# EAGLE design touch_pot (EAGLE 7.2.0)
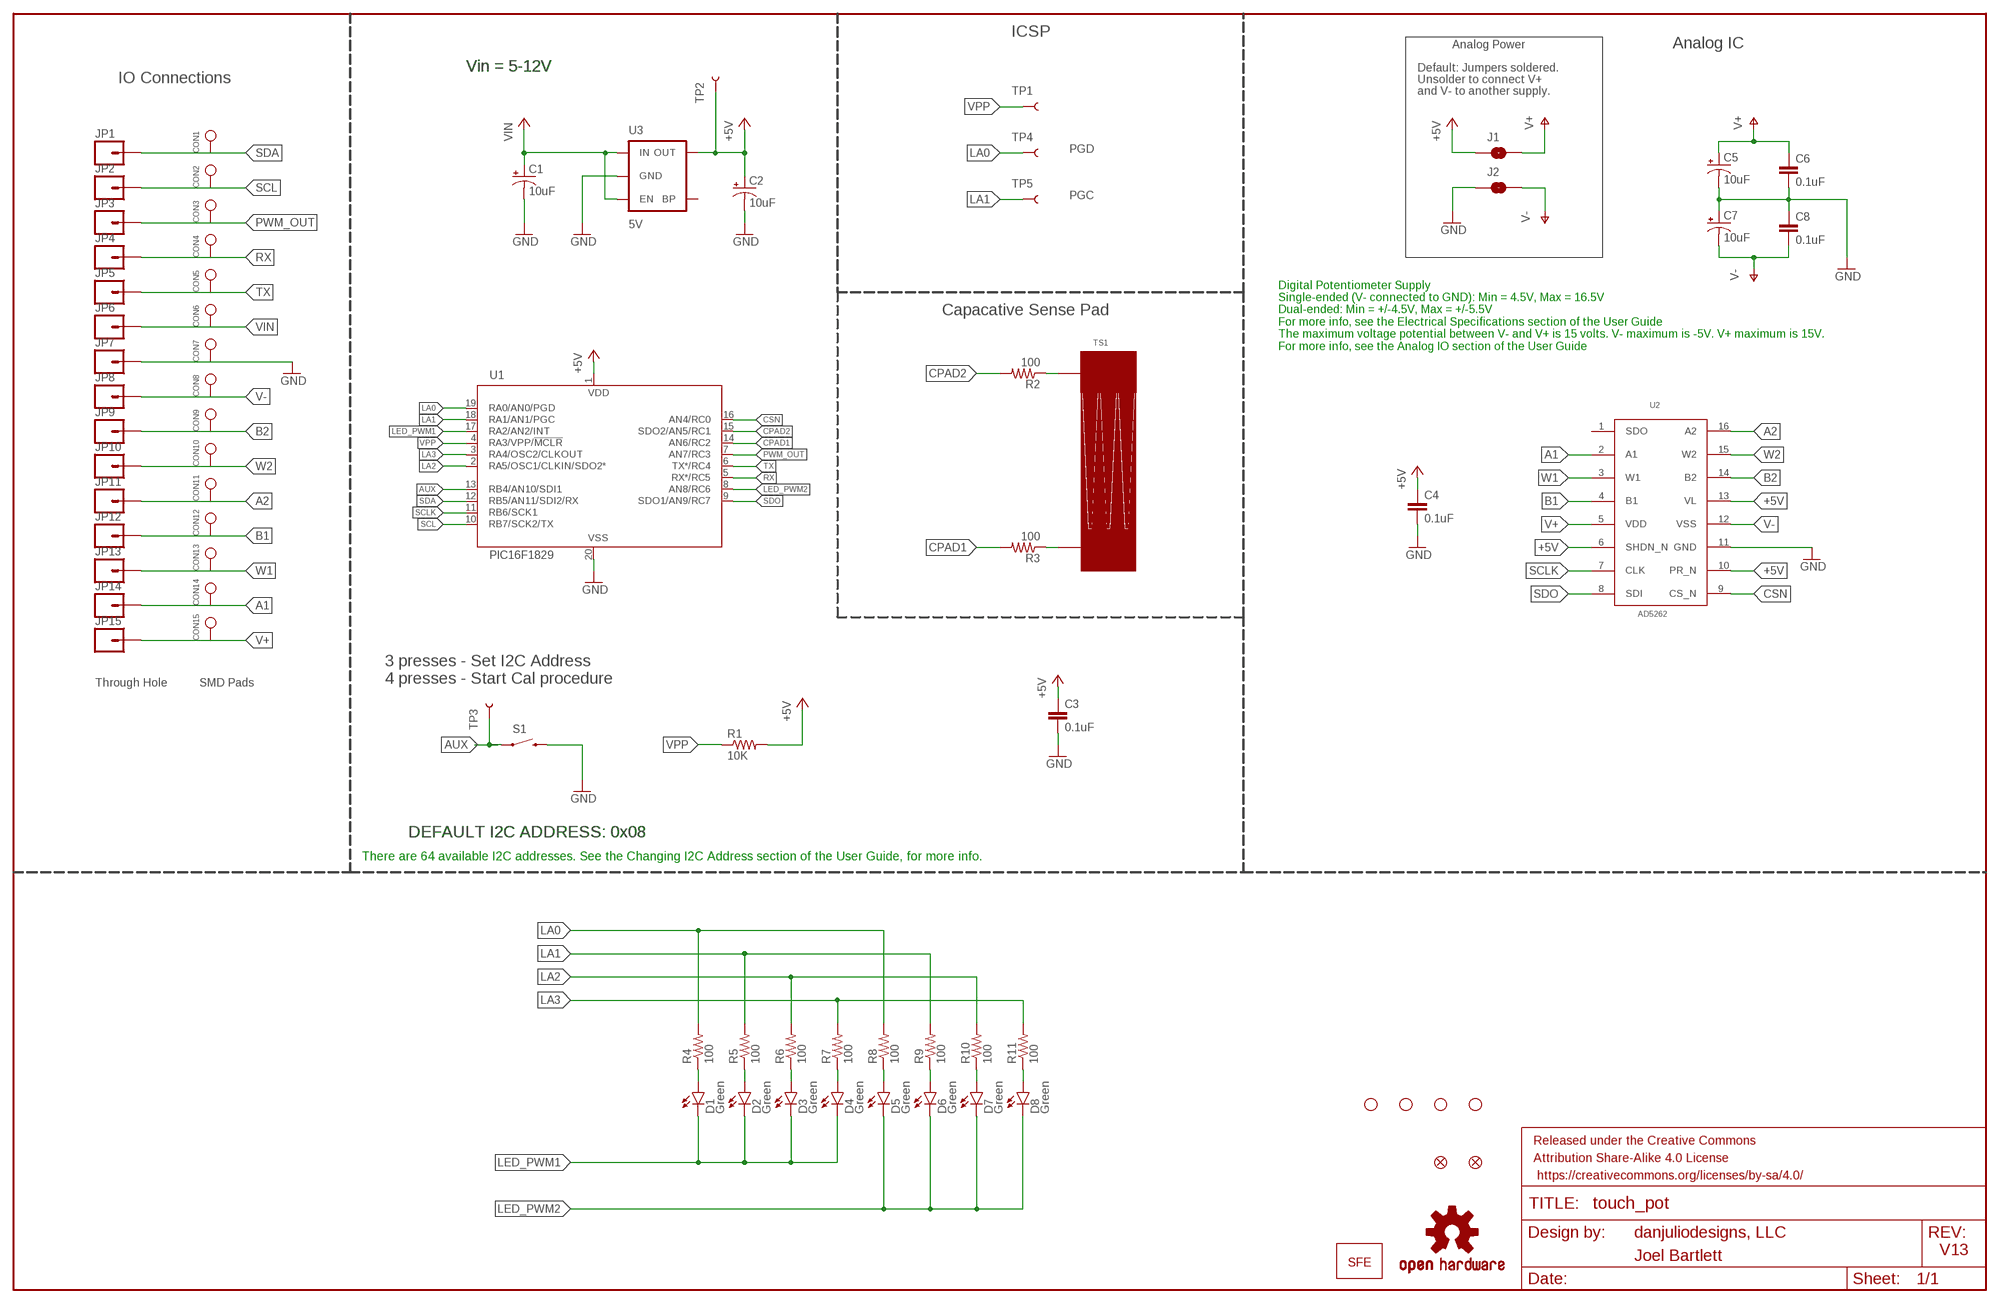
[diagram p0: schematic, sheet 1]

## Parts
C1  10uF  10UF-16V-10%(TANT)  [EIA3216]
C2  10uF  10UF-16V-10%(TANT)  [EIA3216]
C3  0.1uF  0.1UF-25V(+80/-20%)(0603)  [0603-CAP]
C4  0.1uF  0.1UF-25V(+80/-20%)(0603)  [0603-CAP]
C5  10uF  10UF-16V-10%(TANT)  [EIA3216]
C6  0.1uF  0.1UF-25V(+80/-20%)(0603)  [0603-CAP]
C7  10uF  10UF-16V-10%(TANT)  [EIA3216]
C8  0.1uF  0.1UF-25V(+80/-20%)(0603)  [0603-CAP]
CON1  SINGLE_PADSMD  [2MM_SMD_PAD]
CON2  SINGLE_PADSMD  [2MM_SMD_PAD]
CON3  SINGLE_PADSMD  [2MM_SMD_PAD]
CON4  SINGLE_PADSMD  [2MM_SMD_PAD]
CON5  SINGLE_PADSMD  [2MM_SMD_PAD]
CON6  SINGLE_PADSMD  [2MM_SMD_PAD]
CON7  SINGLE_PADSMD  [2MM_SMD_PAD]
CON8  SINGLE_PADSMD  [2MM_SMD_PAD]
CON9  SINGLE_PADSMD  [2MM_SMD_PAD]
CON10  SINGLE_PADSMD  [2MM_SMD_PAD]
CON11  SINGLE_PADSMD  [2MM_SMD_PAD]
CON12  SINGLE_PADSMD  [2MM_SMD_PAD]
CON13  SINGLE_PADSMD  [2MM_SMD_PAD]
CON14  SINGLE_PADSMD  [2MM_SMD_PAD]
CON15  SINGLE_PADSMD  [2MM_SMD_PAD]
D1  Green  LED-GREEN1206-BOTTOM  [LED-1206-BOTTOM]
D2  Green  LED-GREEN1206-BOTTOM  [LED-1206-BOTTOM]
D3  Green  LED-GREEN1206-BOTTOM  [LED-1206-BOTTOM]
D4  Green  LED-GREEN1206-BOTTOM  [LED-1206-BOTTOM]
D5  Green  LED-GREEN1206-BOTTOM  [LED-1206-BOTTOM]
D6  Green  LED-GREEN1206-BOTTOM  [LED-1206-BOTTOM]
D7  Green  LED-GREEN1206-BOTTOM  [LED-1206-BOTTOM]
D8  Green  LED-GREEN1206-BOTTOM  [LED-1206-BOTTOM]
FID1  FIDUCIAL1X2  [FIDUCIAL-1X2]
FID2  FIDUCIAL1X2  [FIDUCIAL-1X2]
FRAME3  FRAME-LEDGER  [CREATIVE_COMMONS]
J1  SJCLOSED  [SJ_2S]
J2  SJCLOSED  [SJ_2S]
JP1  M01SMDNS  [1X01NS]
JP2  M01SMDNS  [1X01NS]
JP3  M01SMDNS  [1X01NS]
JP4  M01SMDNS  [1X01NS]
JP5  M01SMDNS  [1X01NS]
JP6  M01SMDNS  [1X01NS]
JP7  M01SMDNS  [1X01NS]
JP8  M01SMDNS  [1X01NS]
JP9  M01SMDNS  [1X01NS]
JP10  M01SMDNS  [1X01NS]
JP11  M01SMDNS  [1X01NS]
JP12  M01SMDNS  [1X01NS]
JP13  M01SMDNS  [1X01NS]
JP14  M01SMDNS  [1X01NS]
JP15  M01SMDNS  [1X01NS]
R1  10K  10KOHM-1/10W-1%(0603)0603  [0603-RES]
R2  100  100OHM-1/10W-1%(0603)  [0603-RES]
R3  100  100OHM-1/10W-1%(0603)  [0603-RES]
R4  100  100OHM-1/10W-1%(0603)  [0603-RES]
R5  100  100OHM-1/10W-1%(0603)  [0603-RES]
R6  100  100OHM-1/10W-1%(0603)  [0603-RES]
R7  100  100OHM-1/10W-1%(0603)  [0603-RES]
R8  100  100OHM-1/10W-1%(0603)  [0603-RES]
R9  100  100OHM-1/10W-1%(0603)  [0603-RES]
R10  100  100OHM-1/10W-1%(0603)  [0603-RES]
R11  100  100OHM-1/10W-1%(0603)  [0603-RES]
S1  SWITCH-MOMENTARY-2SMD  [TACTILE-SWITCH-SMD]
STANDOFF1  STAND-OFFTIGHT  [STAND-OFF-TIGHT]
STANDOFF2  STAND-OFFTIGHT  [STAND-OFF-TIGHT]
STANDOFF3  STAND-OFFTIGHT  [STAND-OFF-TIGHT]
STANDOFF4  STAND-OFFTIGHT  [STAND-OFF-TIGHT]
TP1  TEST-POINT3X4  [PAD.03X.04]
TP2  TEST-POINT3X4  [PAD.03X.04]
TP3  TEST-POINT3X4  [PAD.03X.04]
TP4  TEST-POINT3X4  [PAD.03X.04]
TP5  TEST-POINT3X4  [PAD.03X.04]
TS1  2CH_LINEAR_TOUCH  [2CH_48MM_LINEAR_TOUCH]
U1  PIC16F1829  [SSOP20]
U2  AD5262  [SSOP16]
U3  5V  V_REG_MIC52055V  [SOT23-5]
U$4  OSHW-LOGOM  [OSHW-LOGO-M]
U$5  SFE_LOGO_NAME_WEB  [SFE-NEW-WEBLOGO]

## Nets
+5V: C2.A(+) C3.1 C4.1 J1.1 R1.2 TP2.P$1 U1.1(VDD) U2.6(SHDN_N) U2.10(PR_N) U2.13(VL) U3.5(OUT)
A1: CON14.P$1 JP14.1 U2.2(A1)
A2: CON11.P$1 JP11.1 U2.16(A2)
AUX: S1.1 TP3.P$1 U1.13(RB4/AN10/SDI1)
B1: CON12.P$1 JP12.1 U2.4(B1)
B2: CON9.P$1 JP9.1 U2.14(B2)
CPAD1: R3.2 U1.14(AN6/RC2)
CPAD2: R2.2 U1.15(SDO2/AN5/RC1)
CSN: U1.16(AN4/RC0) U2.9(CS_N)
GND: C1.C(-) C2.C(-) C3.2 C4.2 C5.C(-) C6.2 C7.A(+) C8.1 CON7.P$1 J2.1 JP7.1 S1.3 U1.20(VSS) U2.11(GND) U3.2(GND)
LA0: R4.2 R8.2 TP4.P$1 U1.19(RA0/AN0/PGD)
LA1: R5.2 R9.2 TP5.P$1 U1.18(RA1/AN1/PGC)
LA2: R6.2 R10.2 U1.2(RA5/OSC1/CLKIN/SDO2*)
LA3: R7.2 R11.2 U1.3(RA4/OSC2/CLKOUT)
LED_PWM1: D1.C D2.C D3.C D4.C U1.17(RA2/AN2/INT)
LED_PWM2: D5.C D6.C D7.C D8.C U1.8(AN8/RC6)
N$1: D1.A R4.1
N$2: D2.A R5.1
N$3: D3.A R6.1
N$4: D4.A R7.1
N$5: D5.A R8.1
N$6: D6.A R9.1
N$7: D7.A R10.1
N$8: D8.A R11.1
N$37: R2.1 TS1.P$2
N$38: R3.1 TS1.P$1
PWM_OUT: CON3.P$1 JP3.1 U1.7(AN7/RC3)
RX: CON4.P$1 JP4.1 U1.5(RX*/RC5)
SCL: CON2.P$1 JP2.1 U1.10(RB7/SCK2/TX)
SCLK: U1.11(RB6/SCK1) U2.7(CLK)
SDA: CON1.P$1 JP1.1 U1.12(RB5/AN11/SDI2/RX)
SDO: U1.9(SDO1/AN9/RC7) U2.8(SDI)
TX: CON5.P$1 JP5.1 U1.6(TX*/RC4)
V+: C5.A(+) C6.1 CON15.P$1 J1.2 JP15.1 U2.5(VDD)
V-: C7.C(-) C8.2 CON8.P$1 J2.2 JP8.1 U2.12(VSS)
VIN: C1.A(+) CON6.P$1 JP6.1 U3.1(IN) U3.3(EN)
VPP: R1.1 TP1.P$1 U1.4(RA3/VPP/!MCLR)
W1: CON13.P$1 JP13.1 U2.3(W1)
W2: CON10.P$1 JP10.1 U2.15(W2)
Unconnected: U2.1(SDO) U3.4(BP)

## Notes on the sheet
- ICSP
- Analog Power | Analog IC
- Vin = 5-12V | Vin = 5-12V | Default: Jumpers soldered.
- IO Connections | Unsolder to connect V+
- and V- to another supply.
- PGD
- PGC
- Capacative Sense Pad
- Digital Potentiometer Supply
  Single-ended (V- connected to GND): Min = 4.5V, Max = 16.5V
  Dual-ended: Min = +/-4.5V, Max = +/-5.5V
  For more info, see the Electrical Specifications section of the User Guide
  The maximum voltage potential between V- and V+ is 15 volts. V- maximum is -5V. V+ maximum is 15V.
  For more info, see the Analog IO section of the User Guide
- 3 presses - Set I2C Address
  4 presses - Start Cal procedure
- Through Hole | SMD Pads
- DEFAULT I2C ADDRESS: 0x08 | DEFAULT I2C ADDRESS: 0x08
- There are 64 available I2C addresses. See the Changing I2C Address section of the User Guide, for more info.
- danjuliodesigns, LLC
- V13
- Joel Bartlett

## Library data of the parts
C1 C2 C5 C7 = SparkFun-Capacitors:10UF-16V-10%(TANT): CAP-00811 1206/EIA-3216 Tantalum capacitor; PROD_ID: CAP-00811
C3 C4 C6 C8 = SparkFun-Capacitors:0.1UF-25V(+80/-20%)(0603): CAP-00810 Ceramic Standard decoupling cap; PROD_ID: CAP-00810
CON1-CON15 = djd_eagle_library:SINGLE_PAD
D1-D8 = SparkFun-LED:LED-GREEN: Various green LEDs Green LEDs used in SFE Production 0603- DIO-00821 LARGE- DIO-00862 LILYPAD- DIO-09910; PROD_ID: DIO-11076
FID1 FID2 = SparkFun-Aesthetics:FIDUCIAL: Fiducial Alignment Points Various fiducial points for machine vision alignment.
FRAME3 = SparkFun-Aesthetics:FRAME-LEDGER: Schematic Frame Standard 11x14 US Ledger frame
J1 J2 = djd_eagle_library:SJ: Solder jumper
JP1-JP15 = SparkFun:M01: Header 1 Standard 1-pin 0.1" header. Use with straight break away headers (SKU : PRT-00116), right angle break away headers (PRT-00553), swiss pins (PRT-00743), machine pins (PRT-00117), and female headers (PRT-00115).
R1 = SparkFun-Resistors:10KOHM-1/10W-1%(0603): RES-00824; PROD_ID: RES-00824
R2-R11 = SparkFun-Resistors:100OHM-1/10W-1%(0603): RES-07863; PROD_ID: RES-07863
S1 = SparkFun-Electromechanical:SWITCH-MOMENTARY-2: Various NO switches- pushbuttons, reed, etc; PROD_ID: SWCH-08247
STANDOFF1-STANDOFF4 = SparkFun-Electromechanical:STAND-OFF: #4 Stand Off This is the mechanical footprint for a #4 phillips button head screw. Use the keepout ring to avoid running the screw head into surrounding components. SKU : PRT-00447
TP1-TP5 = SparkFun-Passives:TEST-POINT: Bare copper test points for troubleshooting or ICT
TS1 = djd_eagle_library:2CH_LINEAR_TOUCH
U1 = SparkFun-DigitalIC:PIC16F1829
U2 = SparkFun-AnalogIC:AD5262
U3 = SparkFun-PowerIC:V_REG_MIC5205: V_REG MIC5219 Standard 3.3V and 5V 150mA LDO voltage regulator in SOT-23 layout. Micrel part MIC5205. BP (by-pass) pin is used to lower output noise with 470pF cap, may be left open.; PROD_ID: VREG-00823
U$4 = SparkFun:OSHW-LOGO: Open Source Hardware Logo This logo indicates the piece of hardware it is found on incorporates a OSHW license and/or adheres to the definition of open source hardware found here: http://freedomdefined.org/OSHW
U$5 = SparkFun-Aesthetics:SFE_LOGO_NAME_WEB: SparkFun.com board silk.

## Board
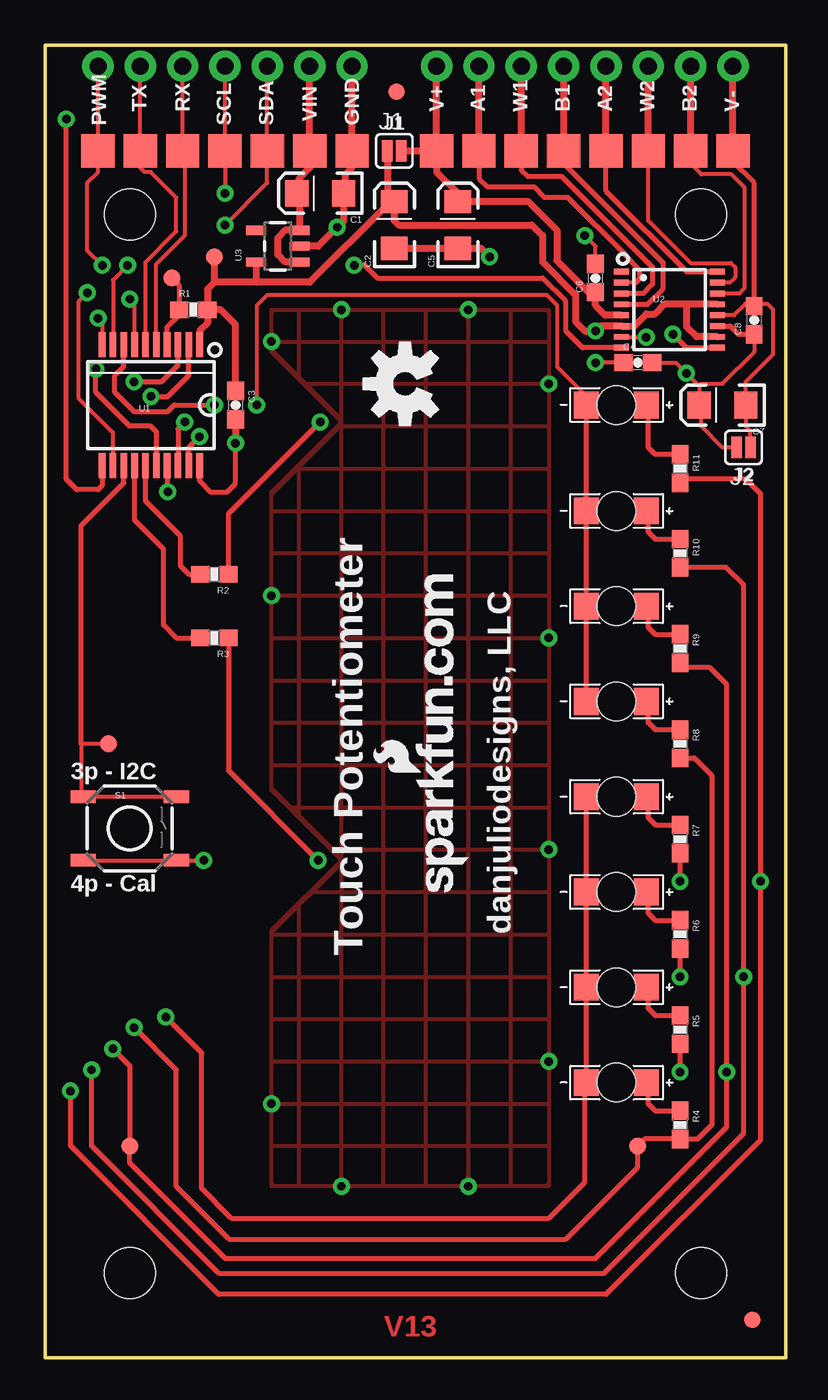
[diagram p1: board, top side]
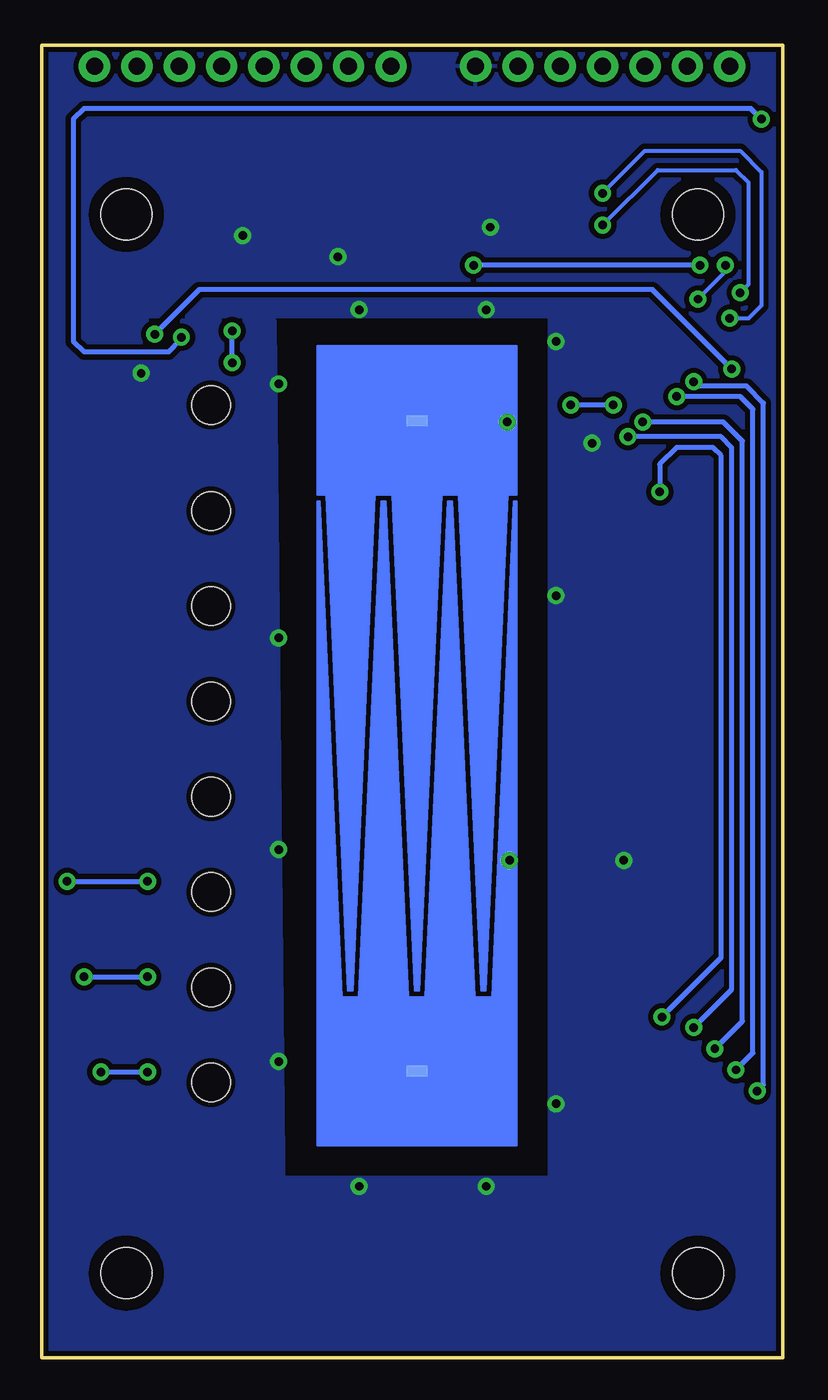
[diagram p2: board, bottom side, seen from below]

Size 44.45 x 78.74 mm. Coordinates in mm from the lower left corner, seen from the top.
Outline: 0,0 44.45,0 44.45,78.74 0,78.74 0,0
Copper layers (1*16): Top 0.035mm / dielectric 1.5mm / Bottom 0.035mm
Design rules "SparkFun-2-layer": minimum track width 7mil, minimum drill 15mil, track to track 8mil, track to pad 8mil, pad to pad 8mil, via to via 8mil, smd to smd 8mil, copper to edge 8mil, drill to drill 8mil, minimum pad ring 12mil, minimum via ring 10mil, stop-mask expansion 4mil, vias tented up to drill 20mil, thermal gap 10mil

### Footprints (pad centres in the part's own frame; a part is rotated, then mirrored left to right if it is on the bottom)
EIA3216 = smd 1.4 x 1.6: A 1.4,0; C -1.4,0
0603-CAP = smd 1.1 x 1: 1 -0.85,0; 2 0.85,0
2MM_SMD_PAD = smd 2 x 2: P$1 0,0
LED-1206-BOTTOM = smd 1.5 x 1.6: A -1.8,0; C 1.8,0 | hole 2.3: 0,0
FIDUCIAL-1X2 = smd 1 x 1: 1 0,0
SJ_2S = smd 0.635 x 1.27: 1 -0.412,0; 2 0.412,0
1X01NS = drill 1.016 pad 1.88: 1 0,0
0603-RES = smd 1.1 x 1: 1 -0.85,0; 2 0.85,0
TACTILE-SWITCH-SMD = smd 1.524 x 0.762: 1 -2.794,1.905; 2 2.794,1.905; 3 -2.794,-1.905; 4 2.794,-1.905
STAND-OFF-TIGHT = hole 3.048: 0,0
PAD.03X.04 = smd 1.016 x 1.016: P$1 0,0
2CH_48MM_LINEAR_TOUCH = smd 1.27 x 0.635: P$1 6,4.5; P$2 6,43.5
SSOP20 = smd 0.4 x 1.5: 1 -2.925,-3.625; 2 -2.275,-3.625; 3 -1.625,-3.625; 4 -0.975,-3.625; 5 -0.325,-3.625; 6 0.325,-3.625; 7 0.975,-3.625; 8 1.625,-3.625; 9 2.275,-3.625; 10 2.925,-3.625; 11 2.925,3.625; 12 2.275,3.625; 13 1.625,3.625; 14 0.975,3.625; 15 0.325,3.625; 16 -0.325,3.625; 17 -0.975,3.625; 18 -1.625,3.625; 19 -2.275,3.625; 20 -2.925,3.625
SSOP16 = smd 0.9 x 0.35: 1 -2.875,2.275; 2 -2.875,1.625; 3 -2.875,0.975; 4 -2.875,0.325; 5 -2.875,-0.325; 6 -2.875,-0.975; 7 -2.875,-1.625; 8 -2.875,-2.275; 9 2.875,-2.275; 10 2.875,-1.625; 11 2.875,-0.975; 12 2.875,-0.325; 13 2.875,0.325; 14 2.875,0.975; 15 2.875,1.625; 16 2.875,2.275
SOT23-5 = smd 0.55 x 1.2: 1 -0.95,-1.3; 2 0,-1.3; 3 0.95,-1.3; 4 0.95,1.3; 5 -0.95,1.3

### Placement (x,y rotation side)
C1  16.51,69.85 180 top
C2  20.95,67.94 90 top
C3  11.43,57.15 270 top
C4  35.56,59.69 0 top
C5  24.77,67.94 90 top
C6  33.02,64.77 90 top
C7  40.64,57.15 180 top
C8  42.55,62.23 90 top
CON1  13.34,72.39 0 top
CON2  10.79,72.39 0 top
CON3  3.17,72.39 0 top
CON4  8.26,72.39 0 top
CON5  5.71,72.39 0 top
CON6  15.88,72.39 0 top
CON7  18.41,72.39 0 top
CON8  41.27,72.39 0 top
CON9  38.73,72.39 0 top
CON10  36.2,72.39 0 top
CON11  33.66,72.39 0 top
CON12  31.11,72.39 0 top
CON13  28.57,72.39 0 top
CON14  26.04,72.39 0 top
CON15  23.5,72.39 0 top
D1  34.29,16.51 180 top
D2  34.29,22.23 180 top
D3  34.29,27.94 180 top
D4  34.29,33.66 180 top
D5  34.29,39.37 180 top
D6  34.29,45.09 180 top
D7  34.29,50.8 180 top
D8  34.29,57.15 180 top
FID1  21.08,75.95 0 top
FID2  42.42,2.29 0 top
FRAME3  21.59,-16.51 0 top  (outside the outline)
J1  20.95,72.39 0 top
J2  41.91,54.61 0 top
JP1  13.34,77.47 0 top
JP2  10.79,77.47 0 top
JP3  3.17,77.47 0 top
JP4  8.26,77.47 0 top
JP5  5.71,77.47 0 top
JP6  15.88,77.47 0 top
JP7  18.41,77.47 0 top
JP8  41.27,77.47 0 top
JP9  38.73,77.47 0 top
JP10  36.2,77.47 0 top
JP11  33.66,77.47 0 top
JP12  31.11,77.47 0 top
JP13  28.57,77.47 0 top
JP14  26.04,77.47 0 top
JP15  23.5,77.47 0 top
R1  8.89,62.87 0 top
R2  10.16,46.99 180 top
R3  10.16,43.18 180 top
R4  38.1,13.97 270 top
R5  38.1,19.68 270 top
R6  38.1,25.4 270 top
R7  38.1,31.11 270 top
R8  38.1,36.83 270 top
R9  38.1,42.55 270 top
R10  38.1,48.26 270 top
R11  38.1,53.34 270 top
S1  5.08,31.75 0 top
STANDOFF1  39.37,68.58 0 top
STANDOFF2  5.08,68.58 0 top
STANDOFF3  5.08,5.08 0 top
STANDOFF4  39.37,5.08 0 top
TP1  7.62,64.77 0 top
TP2  10.16,66.04 0 top
TP3  3.81,36.83 0 top
TP4  35.56,12.7 0 top
TP5  5.08,12.7 0 top
TS1  27.94,12.7 0 bottom
U1  6.35,57.15 180 top
U2  37.47,62.87 0 top
U3  13.97,66.67 90 top
U$4  21.59,58.42 90 top
U$5  25.4,27.94 90 top

### Tracks (layer width: path | path; a pad name or v marks a point on that pad's centre or on a via)
+5V  (via drill 0.51)
  Top 0.254: C4.1 v33.02,59.69
  Top 0.305: U1.1 9.28,61.6
  Top 0.406: 20.45,69.09 15.88,64.52 12.7,64.52 | 20.45,69.09 20.83,69.47 | 20.54,69.76 20.54,69.85 20.83,69.56 20.83,69.47 | 9.28,61.6 9.78,62.1 9.78,62.83 R1.2 | 12.7,64.52 10.16,64.52 | C3.1 11.43,61.98 10.54,62.87 R1.2 | R1.2 9.74,64.1 10.16,64.52 | 20.83,69.47 C2.A 20.95,68.2 21.21,67.94 29.21,67.94 29.84,67.31 29.84,65.73 31.83,63.75 31.83,62.15 32.38,61.59 v33.02,61.59 33.31,61.89 U2.6 35.35,61.89 36.07,62.61 36.58,62.61 37.16,63.19 38.48,63.19 | 12.7,65.69 U3.5 12.67,64.55 12.7,64.52 | U2.13 38.48,63.19 | U2.10 39.09,61.24 38.48,61.85 38.48,63.19 | J1.1 20.54,69.09 20.45,69.09 | 10.16,64.52 TP2.P$1
  Bottom 0.305: v33.02,59.69 v33.02,61.59
A1
  Top 0.254: 35.46,64.49 U2.2
  Top 0.305: 35.46,64.49 35.69,64.72 35.69,65.25 34.77,66.17 34.77,66.19 31.37,69.6 29.97,69.6 29.34,70.23 26.54,70.23 26.04,70.74 CON14.P$1
  Top 0.406: CON14.P$1 JP14.1
A2
  Top 0.305: CON11.P$1 33.66,69.98 38.49,65.14 U2.16
  Top 0.406: CON11.P$1 JP11.1
AUX
  Top 0.254: TP3.P$1 2.16,36.83 2.16,33.78 S1.1
  Top 0.305: 2.16,36.83 2.16,49.91 4.72,52.48 U1.13
B1
  Top 0.305: CON12.P$1 31.11,71.63 37.08,65.66 37.08,64.14 36.14,63.19 U2.4
  Top 0.406: CON12.P$1 JP12.1
B2
  Top 0.254: U2.14 41.64,63.84 41.96,64.16 41.96,70.21 41.17,70.99 39.37,70.99 38.73,71.63 CON9.P$1
  Top 0.406: CON9.P$1 JP9.1
CPAD1
  Top 0.305: R3.2 7.87,43.18 7.11,43.94 7.11,48.51 5.38,50.25 U1.14
CPAD2
  Top 0.305: R2.2 8.64,46.99 8.13,47.5 8.13,49.28 6.03,51.38 U1.15
CSN  (via drill 0.51)
  Top 0.305: v3.05,59.31 3.05,57.91 5.08,55.88 6.35,55.88 6.67,55.55 U1.16 | v37.67,61.39 38.47,60.59 U2.9
  Bottom 0.305: v3.05,59.31 7.81,64.07 34.99,64.07 v37.67,61.39
GND  (via drill 0.51)
  Top 0.254: J2.1 40.64,54.61 39.37,55.88 39.37,57.02 C7.A 39.24,58.29 | 39.24,58.29 39.37,58.42 40.64,58.42 42.55,60.33 C8.1 | 39.24,58.29 v38.48,59.05 37.85,59.69 C4.2 | S1.3 v9.53,29.84 | C6.2 33.02,66.67 v32.38,67.31
  Top 0.305: v11.43,54.86 11.43,52.45 10.92,51.94 9.91,51.94 9.28,52.57 U1.20 | U2.11 41.11,61.89 41.62,61.38 C8.1 | C1.C 17.78,69.98
  Top 0.406: JP7.1 CON7.P$1 18.41,71.37 18.03,70.99 18.03,70.23 17.78,69.98 | v26.67,66.04 26.16,66.55 C5.C C2.C | C3.2 v11.43,54.86 | U3.2 16.38,66.67 v17.53,67.82 17.91,68.2 C1.C
  other vias: 17.78,10.29 25.4,10.29 17.78,62.87 25.4,62.87 13.59,60.96 13.59,45.72 13.59,15.24 30.23,17.78 30.23,30.48 30.23,43.18 30.23,58.42
  pour Bottom (isolate 0.305): 0,0 13.97,0 13.97,72.39 0,72.39
  pour Top (rank 3, hatched): 13.59,62.87 30.23,62.87 30.23,10.29 13.59,10.29 13.59,25.65 17.78,29.84 13.59,34.04 13.59,51.94 17.78,56.13 13.59,60.33
  pour Bottom (isolate 0.305): 29.84,0 44.45,0 44.45,62.23 30.48,62.23
  pour Bottom (isolate 0.305): 0,78.74 44.45,78.74 44.45,62.48 0,62.48
  pour Bottom (isolate 0.305): 0,10.79 44.45,10.79 44.45,0 0,0
LA0  (via drill 0.51)
  Top 0.305: v9.27,55.24 8.62,54.6 U1.19 | v5.33,19.81 7.87,17.27 7.87,10.29 11.05,7.11 31.24,7.11 35.56,11.43 TP4.P$1 35.98,13.12 R4.2 39.16,13.12 40.01,13.97 40.01,34.92 38.95,35.98 R8.2
  Bottom 0.305: v9.27,55.24 3.68,55.24 3.05,54.61 3.05,22.1 v5.33,19.81
LA1  (via drill 0.51)
  Top 0.305: v8.38,56.13 7.97,55.73 U1.18 | v4.06,18.54 5.08,17.53 TP5.P$1 5.08,11.68 10.79,5.97 33.02,5.97 40.89,13.84 v40.89,17.14 40.89,40.39 39.88,41.4 38.29,41.4 38.29,41.5 R9.2 | v38.1,17.14 R5.2
  Bottom 0.305: v8.38,56.13 3.56,56.13 2.41,54.99 2.41,20.19 v4.06,18.54 | v40.89,17.14 v38.1,17.14
LA2  (via drill 0.51)
  Top 0.305: v6.35,57.66 7.37,57.66 8.62,58.92 U1.2 | v2.79,17.27 2.79,12.7 10.41,5.08 33.53,5.08 41.91,13.46 v41.91,22.86 41.91,46.35 40.85,47.41 R10.2 | v38.1,22.86 R6.2
  Bottom 0.305: v2.79,17.27 1.78,18.29 1.78,56.9 2.54,57.66 v6.35,57.66 | v41.91,22.86 v38.1,22.86
LA3  (via drill 0.51)
  Top 0.305: v5.33,58.55 6.99,58.55 7.97,59.54 U1.3 | v1.52,16 1.52,12.7 10.41,3.81 33.66,3.81 42.93,13.08 v42.93,28.57 42.93,51.82 42.04,52.7 38.31,52.7 R11.2 | v38.1,28.57 R7.2
  Bottom 0.305: v5.33,58.55 5.08,58.29 2.16,58.29 1.14,57.28 1.14,16.38 v1.52,16 | v42.93,28.57 v38.1,28.57
LED_PWM1  (via drill 0.51)
  Top 0.305: v7.37,51.94 7.37,53.48 U1.17 | v7.24,20.45 9.4,18.29 9.4,10.16 11.18,8.38 30.23,8.38 32.38,10.54 32.38,16.41 D1.C D2.C D3.C D4.C
  Bottom 0.305: v7.37,51.94 7.37,53.59 6.35,54.61 4.19,54.61 3.68,54.1 3.68,24 v7.24,20.45
LED_PWM2  (via drill 0.51)
  Top 0.254: v12.7,57.15 12.7,63.12 13.34,63.75 30.1,63.75 30.73,63.12 30.73,59.44 32.38,57.78 32.38,57.15 | 32.38,56.57 32.38,57.15 | D8.C 32.38,57.15
  Top 0.305: v10.16,57.15 7.75,57.15 7.37,56.77 5.33,56.77 4.19,57.91 4.19,58.93 4.72,59.46 U1.8 | D5.C D6.C D7.C D8.C
  Top 0.406: 32.38,56.57 32.38,57.09
  Bottom 0.305: v10.16,57.15 v12.7,57.15
N$1
  Top 0.305: R4.1 36.62,14.82 36.2,15.24 36.2,16.41 D1.A
N$2
  Top 0.305: R5.1 36.62,20.54 36.2,20.95 36.2,22.12 D2.A
N$3
  Top 0.305: R6.1 36.62,26.25 36.2,26.67 36.2,27.84 D3.A
N$4
  Top 0.305: R7.1 36.62,31.96 36.2,32.38 36.2,33.55 D4.A
N$5
  Top 0.305: R8.1 36.62,37.68 36.2,38.1 36.2,39.27 D5.A
N$6
  Top 0.305: R9.1 36.62,43.4 36.2,43.81 36.2,44.98 D6.A
N$7
  Top 0.305: R10.1 36.62,49.11 36.2,49.53 36.2,50.7 D7.A
N$8
  Top 0.305: R11.1 36.62,54.19 36.2,54.61 36.2,57.05 D8.A
N$9
  Top 0.254: 7.62,33.66 2.54,33.66
N$10
  Bottom 0.203: 0,77.47 0,78.74
N$37  (via drill 0.51)
  Top 0.305: v16.51,56.13 11.01,50.63 R2.1
  Bottom 0.305: v16.51,56.13 21.87,56.13 TS1.P$2
N$38  (via drill 0.51)
  Top 0.305: v16.38,29.84 11.01,35.22 R3.1
  Bottom 0.254: 16.38,19.56 18.8,17.14 18.92,17.14
  Bottom 0.305: 16.38,19.56 v16.38,29.84 | 18.92,17.14 21.89,17.14 TS1.P$1
PWM_OUT  (via drill 0.51)
  Top 0.254: U1.7 5.38,63.2 v5.08,63.5 | v3.43,65.53 2.54,66.42 2.54,70.48 3.17,71.12 CON3.P$1 JP3.1
  Bottom 0.254: v5.08,63.5 3.43,65.15 v3.43,65.53
RX
  Top 0.254: U1.5 6.67,65.6 8.38,67.31 8.38,72.26 CON4.P$1 JP4.1
SCL  (via drill 0.51)
  Top 0.254: v10.79,69.85 CON2.P$1 JP2.1 | U1.10 3.43,62.1 v3.17,62.36
  Bottom 0.254: v3.17,62.36 2.03,62.36 1.27,63.12 1.27,71.12 2.54,72.39 8.26,72.39 v10.79,69.85
SCLK  (via drill 0.51)
  Top 0.254: 34.62,61.21 v36.07,61.21
  Top 0.305: U2.7 34.62,61.21 | U1.11 3.42,52.32 3.17,52.07 1.91,52.07 1.27,52.7 v1.27,74.3
  Bottom 0.305: v36.07,61.21 36.07,61.09 36.83,60.33 41.91,60.33 42.55,60.96 42.55,74.3 41.91,74.93 1.91,74.93 v1.27,74.3
SDA  (via drill 0.51)
  Top 0.254: U1.12 4.06,53.54 4.06,55.5 2.03,57.53 2.03,63.37 v2.54,63.88 | JP1.1 CON1.P$1 13.34,70.48 v10.79,67.94
  Bottom 0.254: v2.54,63.88 2.03,64.39 2.03,70.48 2.79,71.25 7.49,71.25 v10.79,67.94
SDO  (via drill 0.51)
  Top 0.254: v4.95,65.53 4.08,64.65 U1.9
  Top 0.305: v18.54,65.53 19.18,65.53 19.94,64.77 29.84,64.77 31.24,63.37 31.24,61.59 32.25,60.59 U2.8
  Bottom 0.305: v4.95,65.53 v18.54,65.53
TX
  Top 0.254: U1.6 6.03,65.72 7.87,67.56 7.87,69.6 6.35,71.12 5.97,71.12 5.71,71.37 CON5.P$1 JP5.1
V+
  Top 0.406: J1.2 CON15.P$1 | CON15.P$1 JP15.1 | C5.A 29,69.34 30.71,67.64 30.71,65.81 32.6,63.92 C6.1 33.02,63.12 33.6,62.54 U2.5 | 24.79,69.37 C5.A | CON15.P$1 23.5,71.12 24.77,69.85 C5.A
V-
  Top 0.254: J2.2 42.32,55.59 42.04,55.88 C7.C 42.04,58.55 43.69,60.2 43.69,62.87 43.35,63.21 42.67,63.21 | 42.42,63.21 42,63.21 41.33,62.54 U2.12
  Top 0.305: C8.2 42.55,70.48 41.27,71.75 CON8.P$1 | 42.42,63.21 C8.2 | C8.2 42.67,63.21
  Top 0.406: CON8.P$1 JP8.1
VIN
  Top 0.305: 15.24,69.98 C1.A 15.27,69.69
  Top 0.406: JP6.1 CON6.P$1 15.88,71.37 15.24,70.74 15.24,69.98 | 15.27,69.69 U3.3 14.41,67.62 13.97,67.18 13.97,66.17 14.41,65.72 U3.1
VPP
  Top 0.305: U1.4 7.33,61.81 8.04,62.52 R1.1 8.04,64.35 TP1.P$1
W1
  Top 0.305: U2.3 35.9,63.84 36.45,64.39 36.45,65.41 30.99,70.87 28.96,70.87 28.57,71.25 CON13.P$1
  Top 0.406: CON13.P$1 JP13.1
W2
  Top 0.254: CON10.P$1 36.2,68.2 38.73,65.66 41.15,65.66 41.4,65.41 41.4,64.8 41.1,64.49 U2.15
  Top 0.406: CON10.P$1 JP10.1

### Text on the board
Top: V13
tPlace: TX | RX | V+ | A1 | W1 | B1 | A2 | W2 | B2 | V- | PWM | SCL | SDA | VIN | GND | J1 | J2 | 3p - I2C | 4p - Cal | danjuliodesigns, LLC | Touch Potentiometer
Measures: 0.125(4-40)
tDocu: The 0.09055118 in. (2.3mm) hole is NPTH hole | danjuliodesigns, LLC | Joel Bartlett